# EAGLE schematic wheelBLE - Copia (EAGLE 8.1.0)
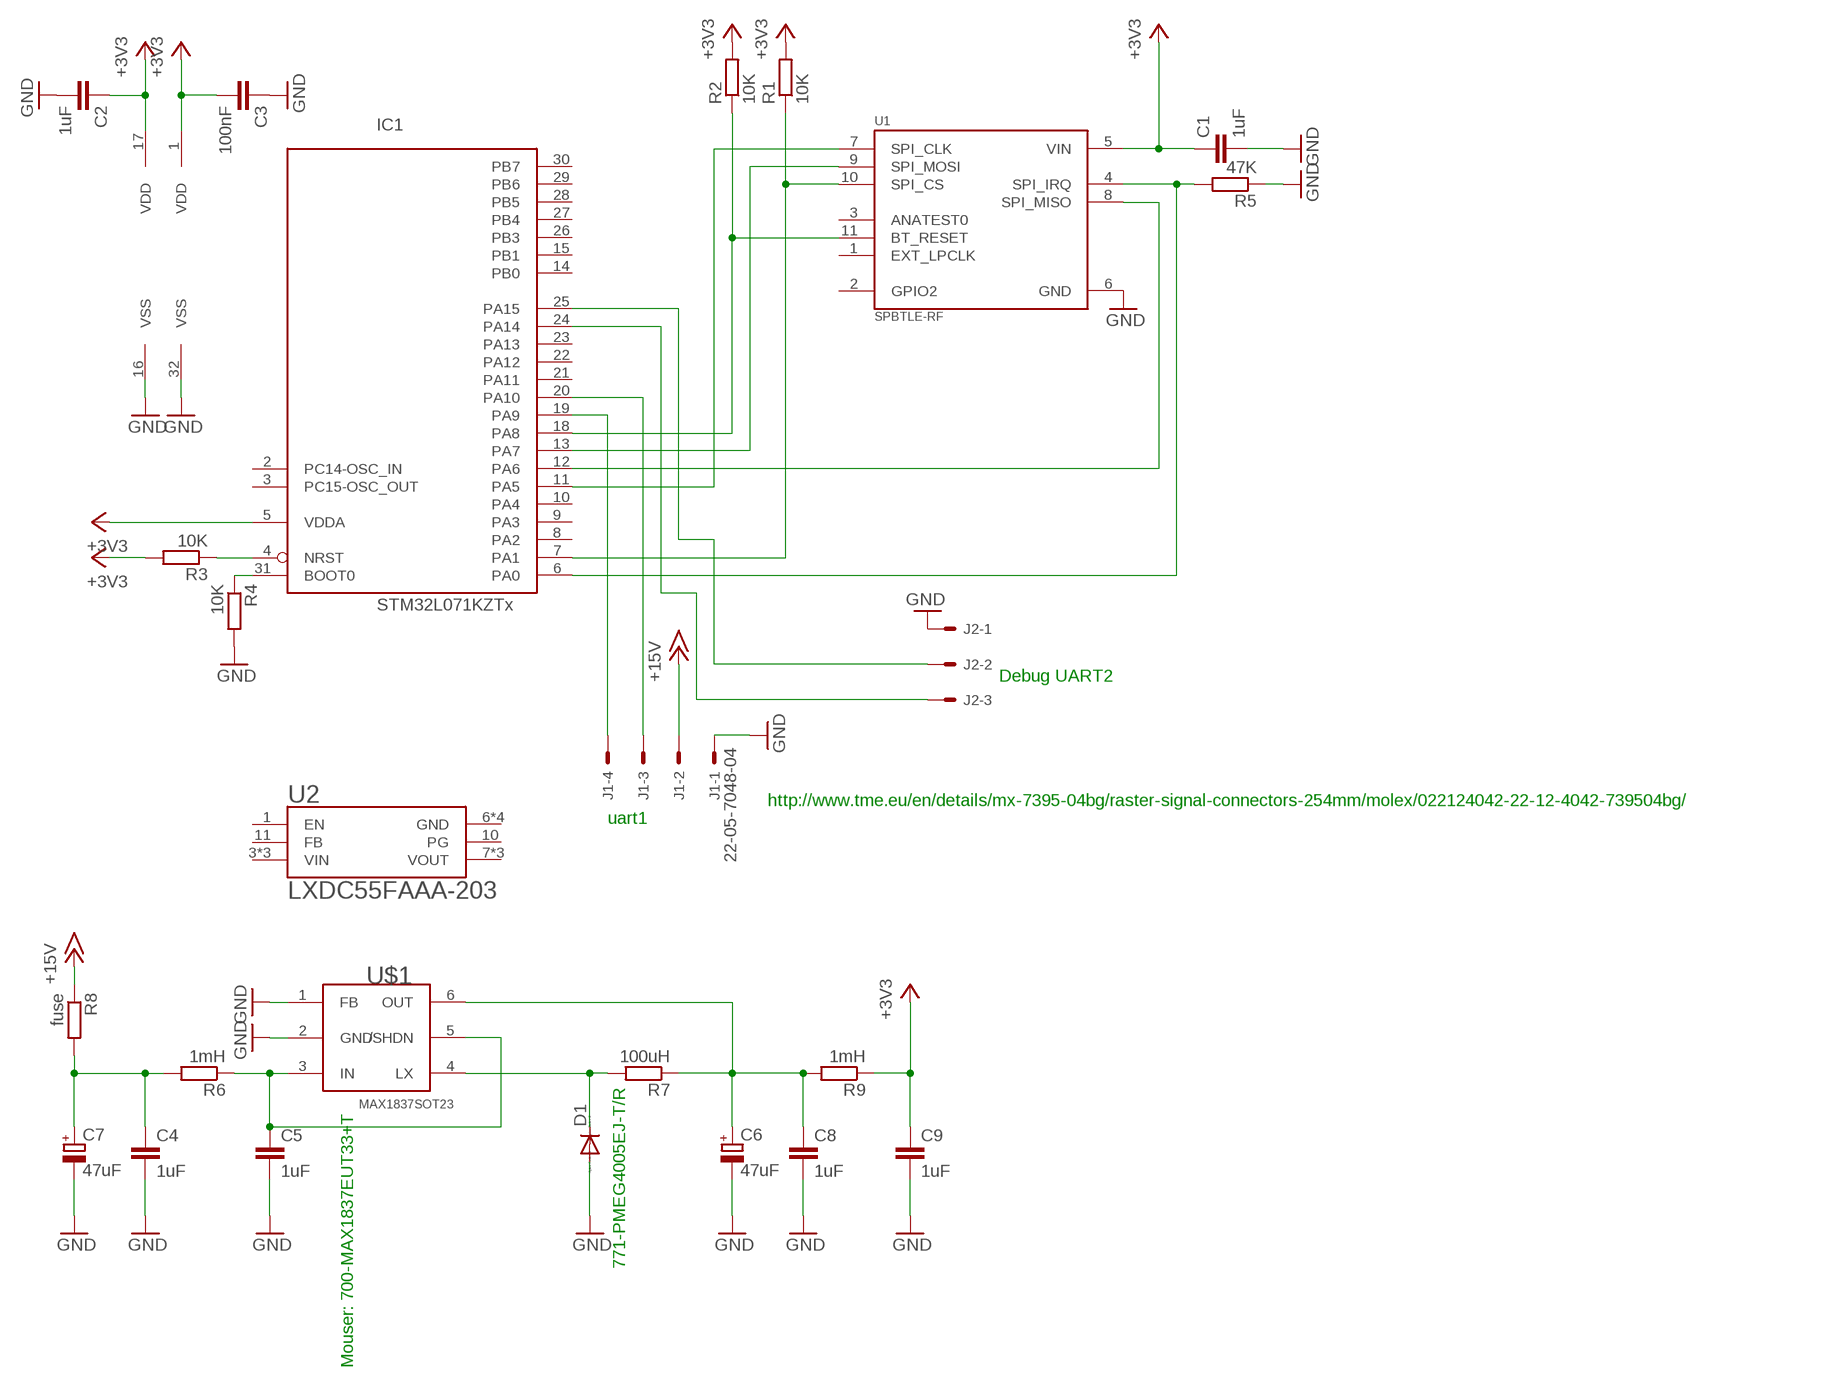
[diagram p0: schematic, sheet 1]

## Parts
C1  1uF  C-EUC0402  [C0402]
C2  1uF  C-EUC0402  [C0402]
C3  100nF  C-EUC0402  [C0402]
C4  1uF  C-EUC0402  [C0402]
C5  1uF  C-EUC0402  [C0402]
C6  47uF  CPOL-EUC  [PANASONIC_C]
C7  47uF  CPOL-EUC  [PANASONIC_C]
C8  1uF  C-EUC0402  [C0402]
C9  1uF  C-EUC0402  [C0402]
D1  DIODE-SOD323-W  [SOD323-W]
IC1  STM32L071KZTx  STM32L051K8T  [LQFP32]
J1  22-05-7048-04  [7395-04]
J2  22-05-7038-03  [7395-03]
R1  10K  R-EU_R0402  [R0402]
R2  10K  R-EU_R0402  [R0402]
R3  10K  R-EU_R0402  [R0402]
R4  10K  R-EU_R0402  [R0402]
R5  47K  R-EU_R0402  [R0402]
R6  1mH  R-EU_R0402  [R0402]
R7  100uH  R-EU_R0402  [R0402]
R8  fuse  R-EU_R0402  [R0402]
R9  1mH  R-EU_R0402  [R0402]
U1  SPBTLE-RF  [XCVR_SPBTLE-RF]
U2  LXDC55FAAA-203  [CONV_LXDC55FAAA-203]
U$1  MAX1837SOT23  [SOT23-6L]

## Nets
+3V3: C1.1 C2.1 C3.2 C9.1 IC1.1(VDD) IC1.5(VDDA) IC1.17(VDD) R1.2 R2.2 R3.2 R9.1 U1.5(VIN)
+15V: J1.2 R8.1
GND: C1.2 C2.2 C3.1 C4.2 C5.2 C6.- C7.- C8.2 C9.2 D1.A IC1.16(VSS) IC1.32(VSS) J1.1 J2.1 R4.2 R5.1 U1.6(GND) U$1.1(FB) U$1.2(GND)
N$1: IC1.7(PA1) R1.1 U1.10(SPI_CS)
N$2: IC1.18(PA8) R2.1 U1.11(BT_RESET)
N$3: IC1.4(NRST) R3.1
N$4: IC1.31(BOOT0) R4.1
N$5: IC1.11(PA5) U1.7(SPI_CLK)
N$6: IC1.12(PA6) U1.8(SPI_MISO)
N$7: IC1.13(PA7) U1.9(SPI_MOSI)
N$8: IC1.6(PA0) R5.2 U1.4(SPI_IRQ)
N$9: IC1.19(PA9) J1.4
N$10: IC1.20(PA10) J1.3
N$11: IC1.24(PA14) J2.3
N$12: IC1.25(PA15) J2.2
N$13: C5.1 R6.1 U$1.3(IN) U$1.5(/SHDN)
N$14: D1.C R7.2 U$1.4(LX)
N$15: C6.+ C8.1 R7.1 R9.2 U$1.6(OUT)
N$16: C4.1 C7.+ R6.2 R8.2
Unconnected: IC1.2(PC14-OSC_IN) IC1.3(PC15-OSC_OUT) IC1.8(PA2) IC1.9(PA3) IC1.10(PA4) IC1.14(PB0) IC1.15(PB1) IC1.21(PA11) IC1.22(PA12) IC1.23(PA13) IC1.26(PB3) IC1.27(PB4) IC1.28(PB5) IC1.29(PB6) IC1.30(PB7) U1.1(EXT_LPCLK) U1.2(GPIO2) U1.3(ANATEST0) U2.1(EN) U2.3(VIN) U2.4(VIN) U2.5(VIN) U2.7(VOUT) U2.8(VOUT) U2.9(VOUT) U2.10(PG) U2.11(FB)

## Notes on the sheet
- Debug UART2
- http://www.tme.eu/en/details/mx-7395-04bg/raster-signal-connectors-254mm/molex/022124042-22-12-4042-739504bg/
- uart1
- Mouser: 700-MAX1837EUT33+T
- 771-PMEG4005EJ-T/R

## Power pins joined to a net without a drawn wire
GND: U2.6(GND) U2.12(GND) U2.13(GND) U2.14(GND)

## Library data of the parts
C1-C5 C8 C9 = rcl:C-EU: CAPACITOR, European symbol
C6 C7 = rcl:CPOL-EU: POLARIZED CAPACITOR, European symbol
D1 = diode:DIODE-: DIODE
IC1 = micro-stm_v2:STM32L051K*T: ARM 32-bit Cortex™-M0+ CPU 32 MHz maximum frequency 32 to 64 Kbytes of Flash memory 2 kbyte of Data EEPROM 8 kbytes of SRAM 27 GPIOs 1.8 to 3.6 V application supply
J1 = EP_molex_6410_7395:22-?-04: CONNECTOR wire to board 2.54 mm (.1 inch) pitch header
J2 = ep_molex_6410_7395-02:22-?-03: CONNECTOR wire to board 2.54 mm (.1 inch) pitch header
R1-R9 = rcl:R-EU_: RESISTOR, European symbol
U1 = SPBTLE-RF:SPBTLE-RF: Very low power module for Bluetooth Smart v4.1; AVAILABILITY: Good; DESCRIPTION: Very low power module for Bluetooth Smart v4.1; MF: STMicroelectronics; MP: SPBTLE-RF; PACKAGE: None; PRICE: 7.77 USD
U2 = LXDC55FAAA-203:LXDC55FAAA-203: Conv DC-DC Quad Step Down 4V to 14V 14-Pin SMD T/R; AVAILABILITY: Good; DESCRIPTION: Conv DC-DC Quad Step Down 4V to 14V 14-Pin SMD T/R; MF: Murata; MP: LXDC55FAAA-203; PACKAGE: SMD-14 Murata; PRICE: 3.06 USD
U$1 = maxim-4:MAX1837